# EAGLE design CMoy - OPA1622 Triple (EAGLE 6.4)

## Sheet 1 of 3
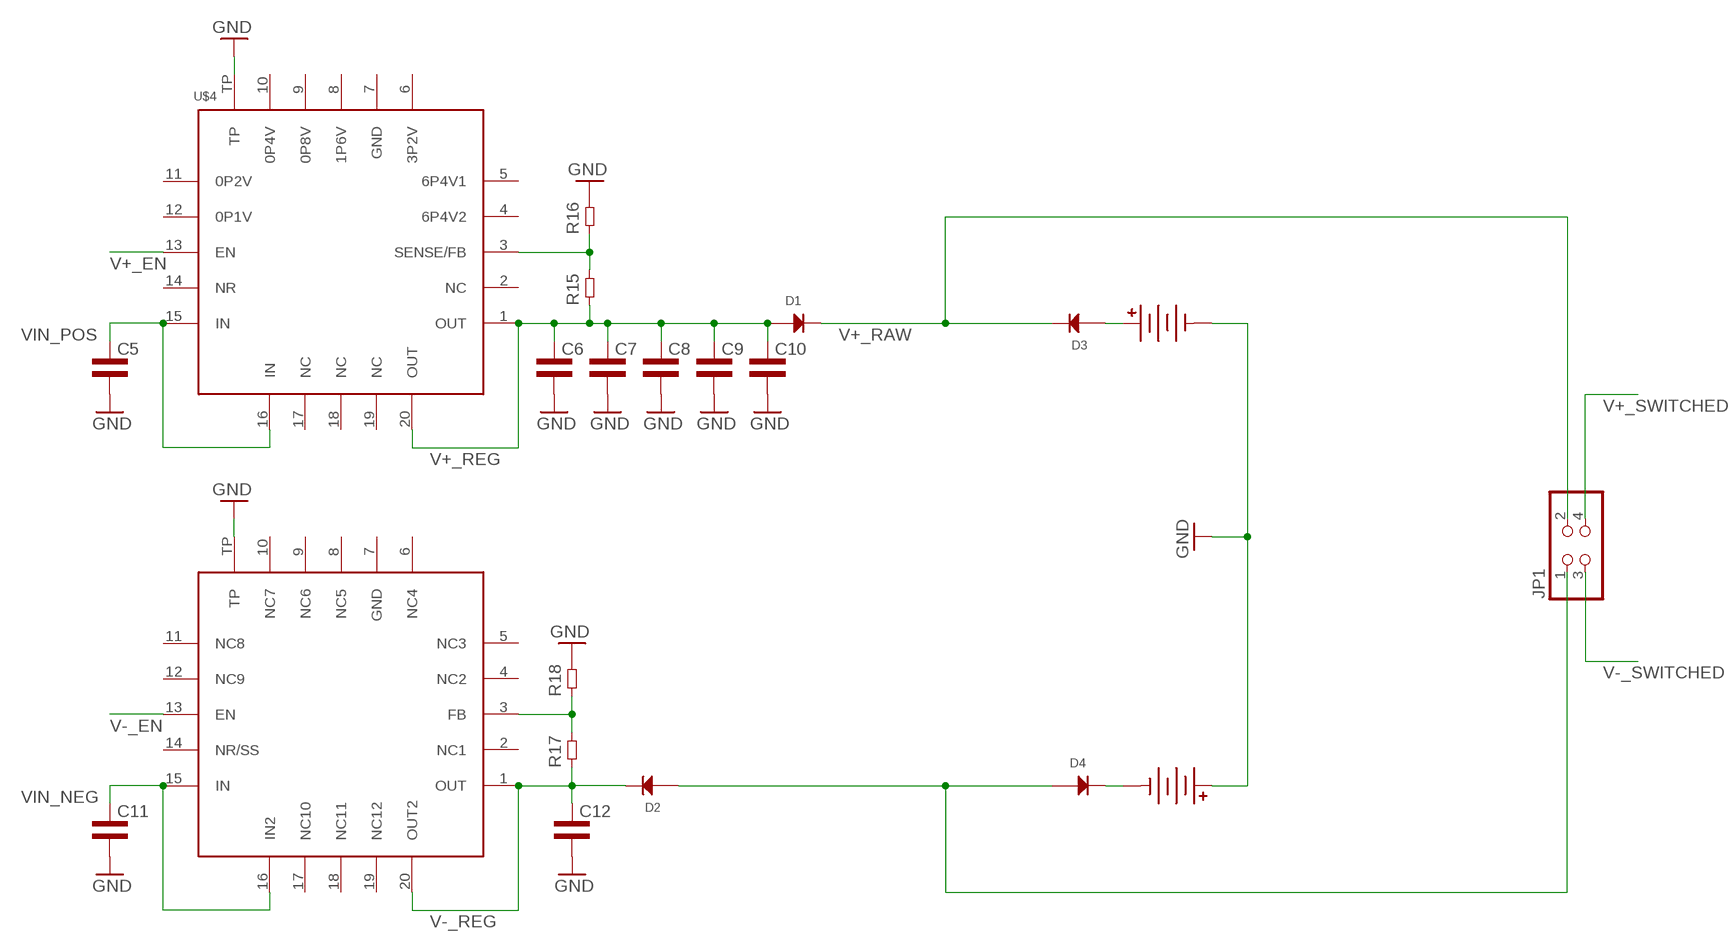
[diagram p0: schematic, sheet 1]

### Parts
BATT1  BATT_9V  [9V_FEMALE]
BATT2  BATT_9V  [9V_FEMALE]
C5  CAP0805L3  [0805L3]
C6  CAP0805L3  [0805L3]
C7  CAP0805L3  [0805L3]
C8  CAP0805L3  [0805L3]
C9  CAP0805L3  [0805L3]
C10  CAP0805L3  [0805L3]
C11  CAP0805L3  [0805L3]
C12  CAP0805L3  [0805L3]
D1  DIODEMINI2-F3-B  [MINI2-F3-B]
D2  DIODEMINI2-F3-B  [MINI2-F3-B]
D3  DIODEMINI2-F3-B  [MINI2-F3-B]
D4  DIODEMINI2-F3-B  [MINI2-F3-B]
JP1  PINHD-2X2  [2X02]
R15  RES0603L3  [0603L3]
R16  RES0603L3  [0603L3]
R17  RES0603L3  [0603L3]
R18  RES0603L3  [0603L3]
U$4  POWER-SUPPLY_POS_V1_TI_LDO_TPS7A4700  [POWER-SUPPLY_POS_V1_TI_LDO_VQFN-20]
U$5  POWER-SUPPLY_POS_V1_TI_LDO_TPS7A3301RGWT  [POWER-SUPPLY_POS_V1_TI_LDO_VQFN-20]

### Nets
GND: BATT1.N1(NEG) BATT1.N2(NEG) BATT1.N3(NEG) BATT2.P1(POS) BATT2.P2(POS) BATT2.P3(POS) C5.2 C6.2 C7.2 C8.2 C9.2 C10.2 C11.2 C12.2 R16.P$2 R18.P$2 U$4.TP U$5.TP ; also sheet 2,3
N$10: BATT1.P1(POS) BATT1.P2(POS) BATT1.P3(POS) D3.2(ANODE)
N$24: BATT2.N1(NEG) BATT2.N2(NEG) BATT2.N3(NEG) D4.1(CATHODE)
V+_EN: U$4.13(EN)
V+_FB: R15.P$2 R16.P$1 U$4.3(SENSE/FB)
V+_RAW: D1.1(CATHODE) D3.1(CATHODE) JP1.2
V+_REG: C6.1 C7.1 C8.1 C9.1 C10.1 D1.2(ANODE) R15.P$1 U$4.1(OUT) U$4.20(OUT)
V+_SWITCHED: JP1.4 ; also sheet 2
V-_EN: U$5.13(EN)
V-_FB: R17.P$2 R18.P$1 U$5.3(FB)
V-_RAW: D2.2(ANODE) D4.2(ANODE) JP1.1
V-_REG: C12.1 D2.1(CATHODE) R17.P$1 U$5.1(OUT) U$5.20(OUT2)
V-_SWITCHED: JP1.3 ; also sheet 2
VIN_NEG: C11.1 U$5.15(IN) U$5.16(IN2)
VIN_POS: C5.1 U$4.15(IN) U$4.16(IN)
Unconnected: U$4.2(NC) U$4.4(6P4V2) U$4.5(6P4V1) U$4.6(3P2V) U$4.7(GND) U$4.8(1P6V) U$4.9(0P8V) U$4.10(0P4V) U$4.11(0P2V) U$4.12(0P1V) U$4.14(NR) U$4.17(NC) U$4.18(NC) U$4.19(NC) U$5.2(NC1) U$5.4(NC2) U$5.5(NC3) U$5.6(NC4) U$5.7(GND) U$5.8(NC5) U$5.9(NC6) U$5.10(NC7) U$5.11(NC8) U$5.12(NC9) U$5.14(NR/SS) U$5.17(NC10) U$5.18(NC11) U$5.19(NC12)

## Sheet 2 of 3
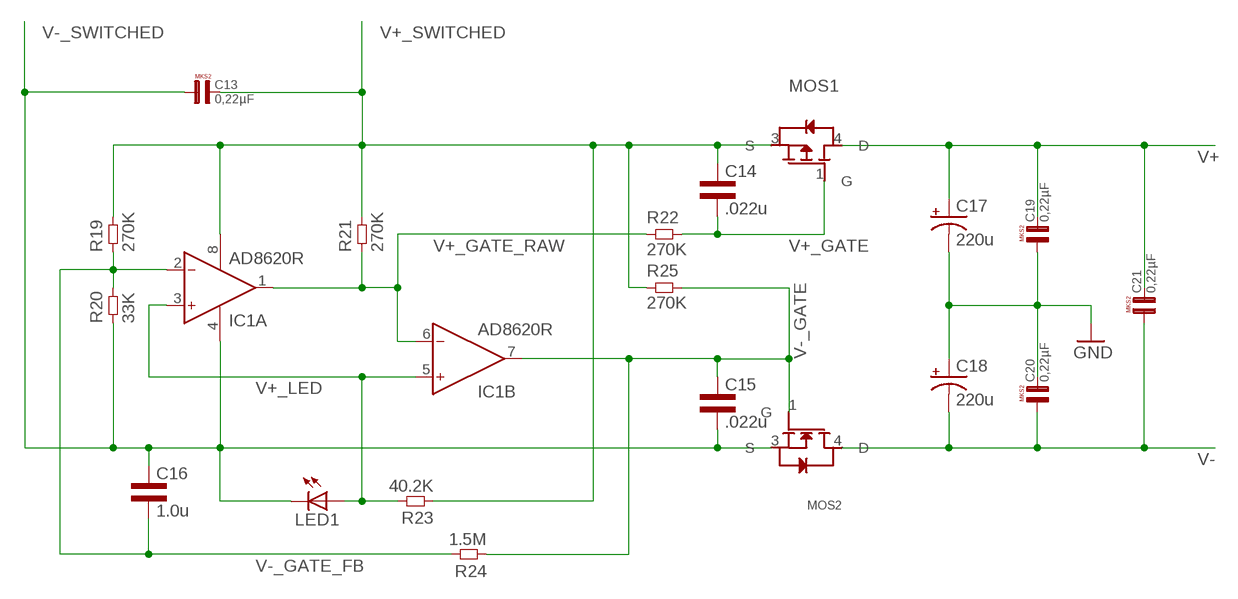
[diagram p1: schematic, sheet 2]

### Parts
C13  0,22µF  [R5B3]
C14  .022u  CAP0603L3  [0603L3]
C15  .022u  CAP0603L3  [0603L3]
C16  1.0u  CAP0603L3  [0603L3]
C17  220u  CPOL-USE3.5-8  [E3,5-8]
C18  220u  CPOL-USE3.5-8  [E3,5-8]
C19  0,22µF  [R5B3]
C20  0,22µF  [R5B3]
C21  0,22µF  [R5B3]
IC1  AD8620R  [SO8]
LED1  LED3MM  [LED3MM]
MOS1  MOSFET-P  [DPAK-3]
MOS2  MOSFET-N  [DPAK-3]
R19  270K  RES0603L3  [0603L3]
R20  33K  RES0603L3  [0603L3]
R21  270K  RES0603L3  [0603L3]
R22  270K  RES0603L3  [0603L3]
R23  40.2K  RES0603L3  [0603L3]
R24  1.5M  RES0603L3  [0603L3]
R25  270K  RES0603L3  [0603L3]

### Nets
GND: C17.- C18.+ C19.1 C20.2 ; also sheet 1,3
V+: C17.+ C19.2 C21.2 MOS1.4(D) ; also sheet 3
V+_GATE: C14.P$2 MOS1.1(G) R22.P$2
V+_GATE_RAW: IC1.1(A:OUT) IC1.6(B:IN-) R21.P$1 R22.P$1
V+_LED: IC1.3(A:IN+) IC1.5(B:IN+) LED1.A R23.P$2
V+_SWITCHED: C13.2 C14.P$1 IC1.8(P:V+) MOS1.3(S) R19.P$2 R21.P$2 R23.P$1 R25.P$1 ; also sheet 1
V-: C18.- C20.1 C21.1 MOS2.4(D) ; also sheet 3
V-_GATE: C15.P$1 IC1.7(B:OUT) MOS2.1(G) R24.P$1 R25.P$2
V-_GATE_FB: C16.P$2 IC1.2(A:IN-) R19.P$1 R20.P$2 R24.P$2
V-_SWITCHED: C13.1 C15.P$2 C16.P$1 IC1.4(P:V-) LED1.K(C) MOS2.3(S) R20.P$1 ; also sheet 1

## Sheet 3 of 3
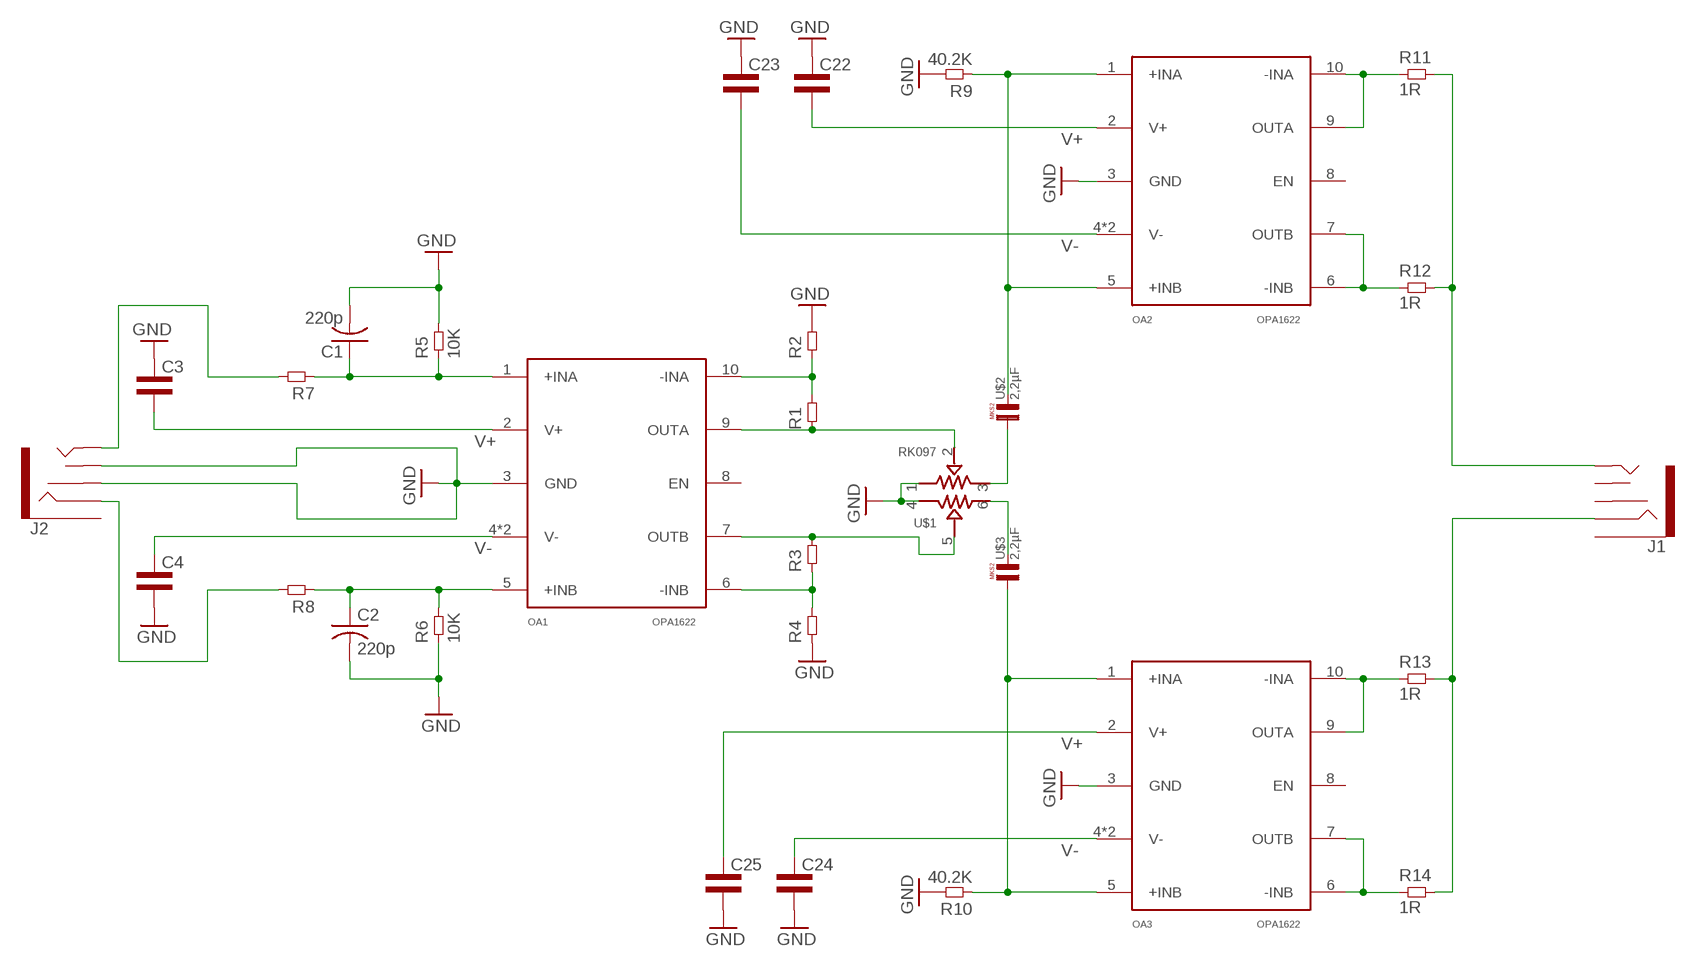
[diagram p2: schematic, sheet 3]

### Parts
C1  220p  C-US025-050X050  [C025-050X050]
C2  220p  C-US025-050X050  [C025-050X050]
C3  CAP0603L3  [0603L3]
C4  CAP0603L3  [0603L3]
C22  CAP0603L3  [0603L3]
C23  CAP0603L3  [0603L3]
C24  CAP0603L3  [0603L3]
C25  CAP0603L3  [0603L3]
J1  AUDIO-JACK2SMD  [AUDIO-JACK-3.5MM-SMD]
J2  AUDIO-JACK2SMD  [AUDIO-JACK-3.5MM-SMD]
OA1  OPA1622  [S-PVSON-N10]
OA2  OPA1622  [S-PVSON-N10]
OA3  OPA1622  [S-PVSON-N10]
R1  RES0603L3  [0603L3]
R2  RES0603L3  [0603L3]
R3  RES0603L3  [0603L3]
R4  RES0603L3  [0603L3]
R5  10K  RES0603L3  [0603L3]
R6  10K  RES0603L3  [0603L3]
R7  RES0603L3  [0603L3]
R8  RES0603L3  [0603L3]
R9  40.2K  RES0603L3  [0603L3]
R10  40.2K  RES0603L3  [0603L3]
R11  1R  RES0805L3  [0805L3]
R12  1R  RES0805L3  [0805L3]
R13  1R  RES0805L3  [0805L3]
R14  1R  RES0805L3  [0805L3]
U$1  RK097  [RK097]
U$2  2,2µF  [R5B7K2]
U$3  2,2µF  [R5B7K2]

### Nets
GND: C1.2 C2.2 C3.P$1 C4.P$2 C22.P$1 C23.P$1 C24.P$2 C25.P$2 J2.RSH J2.TSH OA1.3(GND) OA2.3(GND) OA3.3(GND) R2.P$2 R4.P$1 R5.P$2 R6.P$1 R9.P$2 R10.P$2 U$1.1 U$1.4 ; also sheet 1,2
N$1: C1.1 OA1.1(+INA) R5.P$1 R7.P$1
N$2: C2.1 OA1.5(+INB) R6.P$2 R8.P$1
N$3: OA1.10(-INA) R1.P$2 R2.P$1
N$4: OA1.6(-INB) R3.P$1 R4.P$2
N$5: OA1.9(OUTA) R1.P$1 U$1.2
N$6: OA1.7(OUTB) R3.P$2 U$1.5
N$8: U$1.3 U$2.1
N$11: J2.TIP R7.P$2
N$12: J2.RING R8.P$2
N$13: U$1.6 U$3.2
N$14: OA2.1(+INA) OA2.5(+INB) R9.P$1 U$2.2
N$15: OA3.1(+INA) OA3.5(+INB) R10.P$1 U$3.1
N$16: OA2.9(OUTA) OA2.10(-INA) R11.1
N$17: OA3.9(OUTA) OA3.10(-INA) R13.1
N$18: OA3.6(-INB) OA3.7(OUTB) R14.1
N$19: OA2.6(-INB) OA2.7(OUTB) R12.1
N$20: J1.TIP R11.2 R12.2
N$21: J1.RING R13.2 R14.2
V+: C3.P$2 C22.P$2 C25.P$1 OA1.2(V+) OA2.2(V+) OA3.2(V+) ; also sheet 2
V-: C4.P$1 C23.P$2 C24.P$1 OA1.4(V-) OA1.TP(V-) OA2.4(V-) OA2.TP(V-) OA3.4(V-) OA3.TP(V-) ; also sheet 2
Unconnected: J1.RSH J1.SLEEVE J1.TSH J2.SLEEVE OA1.8(EN) OA2.8(EN) OA3.8(EN)

## Library data of the parts
BATT1 BATT2 = common:BATT_9V: 9V Battery
C1 C2 = rcl:C-US: CAPACITOR, American symbol
C3-C12 C14-C16 C22-C25 = common:CAP
C13 C19-C21 = Capacitor-Wima-MKS2-63v:0,22µF
C17 C18 = rcl:CPOL-US: POLARIZED CAPACITOR, American symbol
D1-D4 = common:DIODE
IC1 = analog-devices:AD8620: Precision, Very Low Noise, Low Input Bias Current, Wide Bandwidth JFET Operational Amplifiers Source: http://www.analog.com/static/imported-files/data_sheets/AD8610_8620.pdf; MF: ALTERA CORPORATION; MPN: AD8620ARZ; OC_FARNELL: 9994386; OC_NEWARK: 59K6972
J1 J2 = SparkFun-Connectors:AUDIO-JACK2: Stereo audio jack with bypass switches. Used on LilyPad MP3 board. Production SKU: CONN-10353; PROD_ID: CONN-10353
JP1 = pinhead:PINHD-2X2: PIN HEADER
LED1 = adafruit:LED: LED OSRAM: - CHIPLED LG R971, LG N971, LY N971, LG Q971, LY Q971, LO R971, LY R971 LH N974, LH R974 LS Q976, LO Q976, LY Q976 LO Q996 - Hyper CHIPLED LW Q18S LB Q993, LB Q99A, LB R99A - SideLED LS A670, LO A670, LY A670, LG A670, LP A670 LB A673, LV A673, LT A673, LW A673 LH A674 LY A675 LS A676, LA A676, LO A676, LY A676, LW A676 LS A679, LY A679, LG A679 - Hyper Micro SIDELED® LS Y876, LA Y876, LO Y876, LY Y876 LT Y87S - SmartLED LW L88C, LW L88S LB L89C, LB L89S, LG L890 LS L89K, LO L89K, LY L89K LS L896, LA L896, LO L896, LY L896 - TOPLED LS T670, LO T670, LY T670, LG T670, LP T670 LSG T670, LSP T670, LSY T670, LOP T670, LYG T670 LG T671, LOG T671, LSG T671 LB T673, LV T673, LT T673, LW T673 LH T674 LS T676, LA T676, LO T676, LY T676, LB T676, LH T676, LSB T676, LW T676 LB T67C, LV T67C, LT T67C, LS T67K, LO T67K, LY T67K, LW E67C LS E67B, LA E67B, LO E67B, LY E67B, LB E67C, LV E67C, LT E67C LW T67C LS T679, LY T679, LG T679 LS T770, LO T770, LY T770, LG T770, LP T770 LB T773, LV T773, LT T773, LW T773 LH T774 LS E675, LA E675, LY E675, LS T675 LS T776, LA T776, LO T776, LY T776, LB T776 LHGB T686 LT T68C, LB T68C - Hyper Mini TOPLED® LB M676 - Mini TOPLED Santana® LG M470 LS M47K, LO M47K, LY M47K Source: http://www.osram.convergy.de/
MOS1 = common:MOSFET-P
MOS2 = common:MOSFET-N
OA1-OA3 = common:OPA1622
R1-R25 = common:RES
U$1 = SparkFun-Electromechanical:RK097
U$2 U$3 = Capacitor-Wima-MKS2-63v:2,2µF
U$4 = my_dac_amp:POWER-SUPPLY_POS_V1_TI_LDO_TPS7A4700
U$5 = my_dac_amp:POWER-SUPPLY_POS_V1_TI_LDO_TPS7A3301RGWT: Ultra-Low Noise NEGATIVE Voltage Reglator

## Board
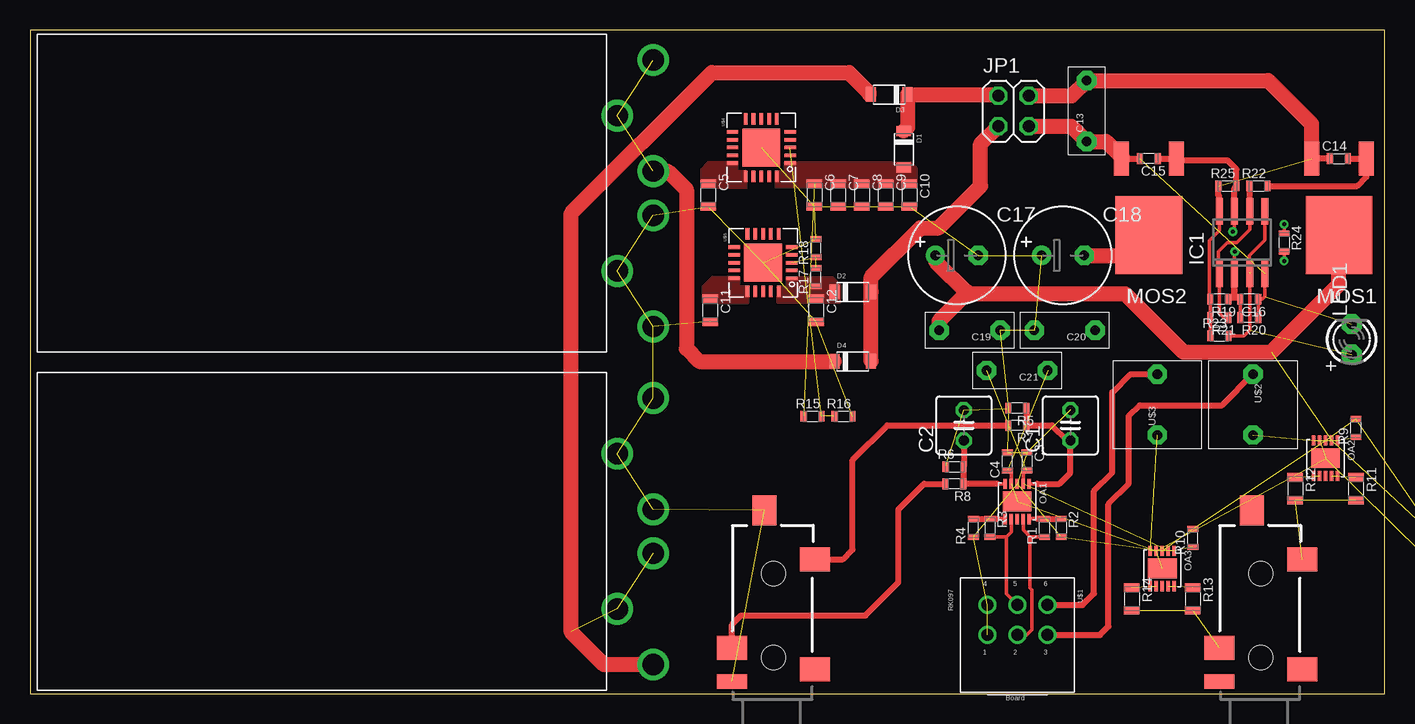
[diagram p3: board, top side]
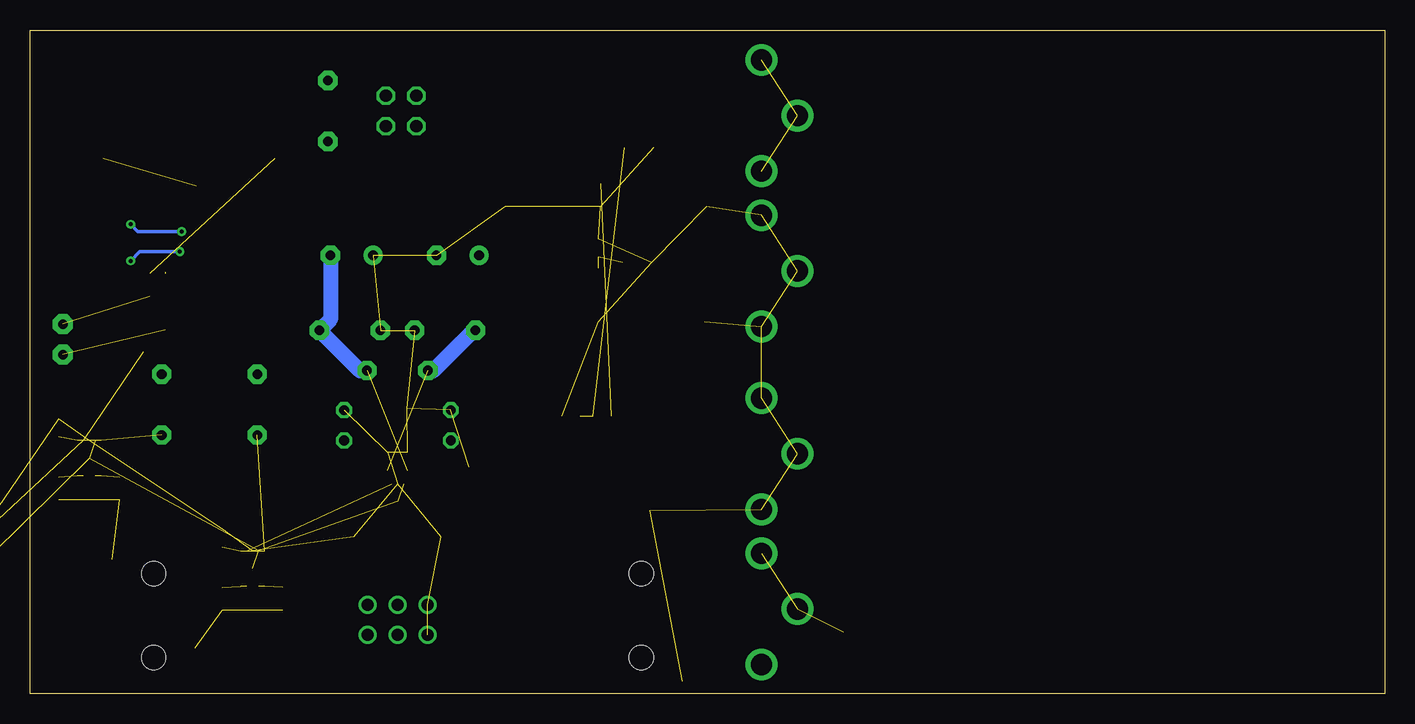
[diagram p4: board, bottom side, seen from below]

Size 112.93 x 55.37 mm. Coordinates in mm from the lower left corner, seen from the top.
Outline: 0,0 112.93,0 112.93,55.37 0,55.37 0,0
Copper layers (1*16): Top 0.035mm / dielectric 1.5mm / Bottom 0.035mm
Design rules "default": minimum track width 10mil, minimum drill 24mil, track to track 8mil, track to pad 8mil, pad to pad 8mil, via to via 8mil, smd to smd 8mil, copper to edge 40mil, drill to drill 8mil, minimum pad ring 10mil, minimum via ring 8mil, stop-mask expansion 4mil, vias tented up to drill 0mil, thermal gap 10mil

### Footprints (pad centres in the part's own frame; a part is rotated, then mirrored left to right if it is on the bottom)
9V_FEMALE = drill 1.77: N1 -11.11,26.2; N2 -6.475,23.2; N3 -1.84,26.2; P1 1.84,26.2; P2 6.475,23.2; P3 11.11,26.2
C025-050X050 = drill 0.813 octagon: 1 -1.27,0; 2 1.27,0
0603L3 = smd 0.5 x 0.9: P$1 -0.75,0; P$2 0.75,0
0805L3 = smd 0.7 x 1.3: 1 -0.95,0; 2 0.95,0
R5B3 = drill 0.813 pad 1.6 octagon: 1 -2.54,0; 2 2.54,0
E3,5-8 = drill 0.813 pad 1.6: + -1.778,0 | drill 0.813 pad 1.6 octagon: - 1.778,0
MINI2-F3-B = smd 0.85 x 1.2: 1 -1.525,0; 2 1.525,0
SO8 = smd 0.6 x 2.2: 1 -1.905,-2.6; 2 -0.635,-2.6; 3 0.635,-2.6; 4 1.905,-2.6; 5 1.905,2.6; 6 0.635,2.6; 7 -0.635,2.6; 8 -1.905,2.6
AUDIO-JACK-3.5MM-SMD = smd 2 x 2.5: RING 4.3,3.45; SLEEVE 2.5,-3.45; TIP 11.7,-3.45 | smd 1.2 x 2.5: RSH 1.5,3.45 | smd 2.5 x 2: TSH 15.75,0.75 | hole 2: 3.5,0; 10.5,0
2X02 = drill 1.016 octagon: 1 -1.27,-1.27; 2 -1.27,1.27; 3 1.27,-1.27; 4 1.27,1.27
LED3MM = drill 0.813 pad 1.676 octagon: A -1.27,0; K 1.27,0
DPAK-3 = smd 1.25 x 2.85: 1 -2.28,-3.2; 3 2.28,-3.2 | smd 5.55 x 6.5: 4 0,3.2
S-PVSON-N10 = smd 0.28 x 0.85: 1 -1,-1.475; 2 -0.5,-1.475; 3 0,-1.475; 4 0.5,-1.475; 5 1,-1.475; 6 1,1.475; 7 0.5,1.475; 8 0,1.475; 9 -0.5,1.475; 10 -1,1.475 | smd 2.4 x 1.65: TP 0,0
RK097 = drill 1: 1 2.5,0; 2 0,0; 3 -2.5,0; 4 2.5,-2.5; 5 0,-2.5; 6 -2.5,-2.5
R5B7K2 = drill 0.813 pad 1.6 octagon: 1 -2.54,0; 2 2.54,0
POWER-SUPPLY_POS_V1_TI_LDO_VQFN-20 = smd 0.3 x 0.95: 1 -1.3,-2.4; 2 -0.65,-2.4; 3 0,-2.4; 4 0.65,-2.4; 5 1.3,-2.4; 11 1.3,2.4; 12 0.65,2.4; 13 0,2.4; 14 -0.65,2.4; 15 -1.3,2.4 | smd 0.95 x 0.3: 6 2.4,-1.3; 7 2.4,-0.65; 8 2.4,0; 9 2.4,0.65; 10 2.4,1.3; 16 -2.4,1.3; 17 -2.4,0.65; 18 -2.4,0; 19 -2.4,-0.65; 20 -2.4,-1.3 | smd 3.15 x 3.15: TP 0,0

### Placement (x,y rotation side)
BATT1  25.76,13.56 270 top
BATT2  25.76,41.76 270 top
C1  86.74,22.4 90 top
C2  77.85,22.4 90 top
C3  83.11,19.41 270 top
C4  81.48,19.41 90 top
C5  56.54,41.61 270 top
C6  65.38,41.61 270 top
C7  67.36,41.61 270 top
C8  69.34,41.61 270 top
C9  71.32,41.61 270 top
C10  73.3,41.61 270 top
C11  56.69,32 270 top
C12  65.53,32 270 top
C13  88.09,48.62 90 top
C14  109.12,44.65 0 top
C15  93.27,44.65 180 top
C16  101.65,32.92 180 top
C17  77.27,36.58 0 top
C18  86.11,36.58 0 top
C19  78.33,30.33 180 top
C20  86.26,30.33 180 top
C21  82.3,26.97 180 top
C22  120.85,8.99 0 top  (outside the outline)
C23  120.85,6.25 0 top  (outside the outline)
C24  120.85,3.51 0 top  (outside the outline)
C25  120.85,0.76 0 top  (outside the outline)
D1  72.85,45.42 270 top
D2  68.58,33.53 0 top
D3  71.63,49.99 180 top
D4  68.58,27.74 0 top
IC1  101.04,37.64 0 top
J1  102.62,-0.46 90 top
J2  61.98,-0.46 90 top
JP1  81.99,48.62 0 top
LED1  110.19,29.57 90 top
MOS1  109.12,41.45 180 top
MOS2  93.27,41.45 180 top
OA1  82.3,16.05 180 top
OA2  108,19.66 180 top
OA3  94.39,10.46 180 top
R1  84.58,13.87 90 top
R2  85.95,13.87 270 top
R3  80.01,13.87 270 top
R4  78.64,13.87 90 top
R5  82.3,23.83 180 top
R6  77.06,18.95 0 top
R7  82.3,22.4 180 top
R8  77.06,17.53 180 top
R9  110.54,22.2 90 top
R10  96.93,13 90 top
R11  110.54,17.12 270 top
R12  105.46,17.12 270 top
R13  96.93,7.92 270 top
R14  91.85,7.92 270 top
R15  65.23,23.16 0 top
R16  67.82,23.16 0 top
R17  65.53,34.75 90 top
R18  65.53,37.19 90 top
R19  99.14,32.92 180 top
R20  101.65,31.39 180 top
R21  99.14,31.39 180 top
R22  102.41,42.37 0 top
R23  99.14,29.87 0 top
R24  104.55,37.64 270 top
R25  99.82,42.37 0 top
U$1  82.3,4.93 180 top
U$2  101.96,24.13 270 top
U$3  93.98,24.13 90 top
U$4  60.96,45.57 90 top
U$5  61.11,35.97 90 top

### Tracks (layer width: path | path; a pad name or v marks a point on that pad's centre or on a via)
GND  (42 unrouted)
N$1
  Top 0.279: OA1.1 83.97,17.53
  Top 0.508: R5.P$1 R7.P$1 85.19,22.4 86.46,21.13 C1.1 86.72,21.11 86.72,18.44 85.8,17.53 83.97,17.53
N$2
  Top 0.279: OA1.5 80.62,17.53
  Top 0.508: C2.1 77.85,18.99 R6.P$2 R8.P$1 80.62,17.53
N$3
  Top 0.279: 83.97,14.63 83.35,14.63 OA1.10
  Top 0.508: R2.P$1 R1.P$2 83.98,14.62 83.97,14.63
N$4
  Top 0.279: 80.62,14.63 81.24,14.63 OA1.6
  Top 0.508: R4.P$2 R3.P$1 80.61,14.62 80.62,14.63
N$5
  Top 0.279: OA1.9 82.8,13.67 83.36,13.11 | 83.36,13.11 83.36,8.84 83.52,8.69 83.52,5.33 83.06,4.88 82.35,4.88 U$1.2 | R1.P$1 83.37,13.12 83.36,13.11
N$6
  Top 0.279: OA1.7 81.8,13.52 81.38,13.11 | 81.38,13.11 81.38,8.34 U$1.5 | R3.P$2 81.37,13.12 81.38,13.11
N$8
  Top 0.508: U$1.3 89.2,4.93 89.92,5.64 89.92,15.85 91.59,17.53 91.59,23.16 92.51,24.08 99.36,24.08 U$2.1
N$10  (2 unrouted)
  Top 0.762: D3.2 69.95,49.99
  Top 1.27: BATT1.P3 47.84,2.45 45.11,5.18 45.11,40.08 56.85,51.82 68.28,51.82 69.95,50.14 69.95,49.99
N$11
  Top 0.508: J2.TIP 67.78,11.24 68.58,12.04 68.58,19.51 71.48,22.4 R7.P$2
N$12
  Top 0.508: J2.RING 58.53,5.8 59.28,6.55 69.65,6.55 72.39,9.3 72.39,15.39 74.52,17.53 R8.P$2
N$13
  Top 0.508: U$1.6 87.74,7.43 88.7,8.38 88.7,16.92 90.22,18.44 90.22,25.15 91.74,26.67 U$3.2
N$14  (3 unrouted)
N$15  (3 unrouted)
N$16  (2 unrouted)
N$17  (2 unrouted)
N$18  (2 unrouted)
N$19  (2 unrouted)
N$20  (2 unrouted)
N$21  (2 unrouted)
N$24  (2 unrouted)
  Top 1.27: BATT2.N3 53.18,43.6 54.71,42.06 54.71,28.8 55.78,27.74 D4.1
V+  (5 unrouted)
  Top 0.279: OA1.2 82.8,18.34 C3.P$2
  Top 1.27: C17.+ 75.49,36.07 78.18,33.38 | 78.18,33.38 91.29,33.38 96.16,28.5 103.48,28.5 109.12,34.14 109.12,37.95 108.97,38.1 | 109.27,38.1 108.97,38.1 | 108.97,38.1 MOS1.4 | C19.2 75.79,31.14 78.18,33.53 78.18,33.38
  Bottom 1.27: C21.2 79.3,26.97 75.79,30.48 C19.2
V+_FB  (2 unrouted)
V+_GATE
  Top 0.508: R22.P$2 110.64,42.37 111.4,43.13 MOS1.1 C14.P$2
V+_GATE_RAW
  Top 0.279: IC1.6 101.68,38.73 100.58,37.64 99.82,37.64 99.06,36.88 99.06,35.12 IC1.1
  Top 0.305: IC1.1 99.14,31.78 99.52,31.39 R21.P$1
  Top 0.508: IC1.6 101.68,42.35 R22.P$1
V+_LED  (2 unrouted)
  Top 0.279: IC1.5 102.95,37.87 101.65,36.58 101.65,35.2
  Top 0.305: IC1.3 101.68,30.35 101.19,29.87 R23.P$2
V+_RAW
  Top 1.27: D1.1 73.15,47.25 D3.1 80.62,49.99 JP1.2
V+_REG  (1 unrouted)
  pour Top (no thermals): 62.94,44.35 73.46,44.35 73.91,43.89 73.91,42.21 62.18,42.21 62.18,43.59 62.94,43.59
V+_SWITCHED  (1 unrouted)
  Top 0.279: R23.P$1 R21.P$2 R19.P$2 98.3,33.01 98.3,37.8 99.14,38.63 IC1.8
  Top 0.508: IC1.8 99.14,41.53 99.06,41.61 99.06,42.36 R25.P$1 | C14.P$1 MOS1.3
  Top 1.27: MOS1.3 106.83,47.55 103.23,51.16 C13.2 86.82,49.89 JP1.4
V-  (8 unrouted)
  Top 0.279: OA1.4 81.8,18.34 C4.P$1
  Top 1.27: C18.- 91.9,36.58 93.42,38.1 93.42,38.25 MOS2.4
  Bottom 1.27: C18.- 87.88,31.24 C20.1 85.45,26.97 C21.1
V-_FB  (2 unrouted)
V-_GATE  (via drill 0.33)
  Top 0.229: MOS2.1 95.71,44.5 95.7,44.5 MOS2.1
  Top 0.279: IC1.7 100.41,38.68 v100.28,38.56 | v104.55,39.17 R24.P$1
  Top 0.508: 95.7,44.5 99.82,44.5 100.57,43.75 R25.P$2 100.41,42.2 IC1.7 | C15.P$1 MOS2.1
  Bottom 0.279: v100.28,38.56 103.94,38.56 v104.55,39.17
V-_GATE_FB  (via drill 0.33)
  Top 0.254: 100.43,33.07 100.58,33.07 100.74,32.92
  Top 0.279: IC1.2 100.41,36.86 v100.43,36.88 | R24.P$2 v104.55,36.12
  Top 0.305: R20.P$2 C16.P$2 100.74,32.92 R19.P$1
  Top 0.559: IC1.2 100.41,33.1 100.43,33.07
  Bottom 0.279: v100.43,36.88 103.78,36.88 v104.55,36.12
V-_RAW
  Top 1.27: D4.2 D2.2 70.11,34.75 74.22,38.86 75.74,38.86 79.25,42.37 79.25,45.87 JP1.1
V-_REG
  pour Top (no thermals): 63.09,34.75 66.9,34.75 67.51,34.14 67.51,32.61 62.33,32.61 62.33,33.99 63.09,33.99
V-_SWITCHED  (2 unrouted)
  Top 0.279: R20.P$1 C16.P$1 102.72,32.92 102.95,33.15 IC1.4
  Top 0.508: MOS2.3 91.14,44.65 C15.P$2
  Top 1.27: 91.14,44.65 89.71,46.08 C13.1 86.82,47.35 JP1.3
VIN_NEG
  pour Top (no thermals): 59.13,34.75 56.85,34.75 56.08,33.99 56.08,32.61 59.89,32.61 59.89,33.99 59.13,33.99
VIN_POS
  pour Top (no thermals): 58.98,44.35 56.54,44.35 55.93,43.74 55.93,42.21 59.74,42.21 59.74,43.59 58.98,43.59